# Altium project DAC_board.PrjPcb
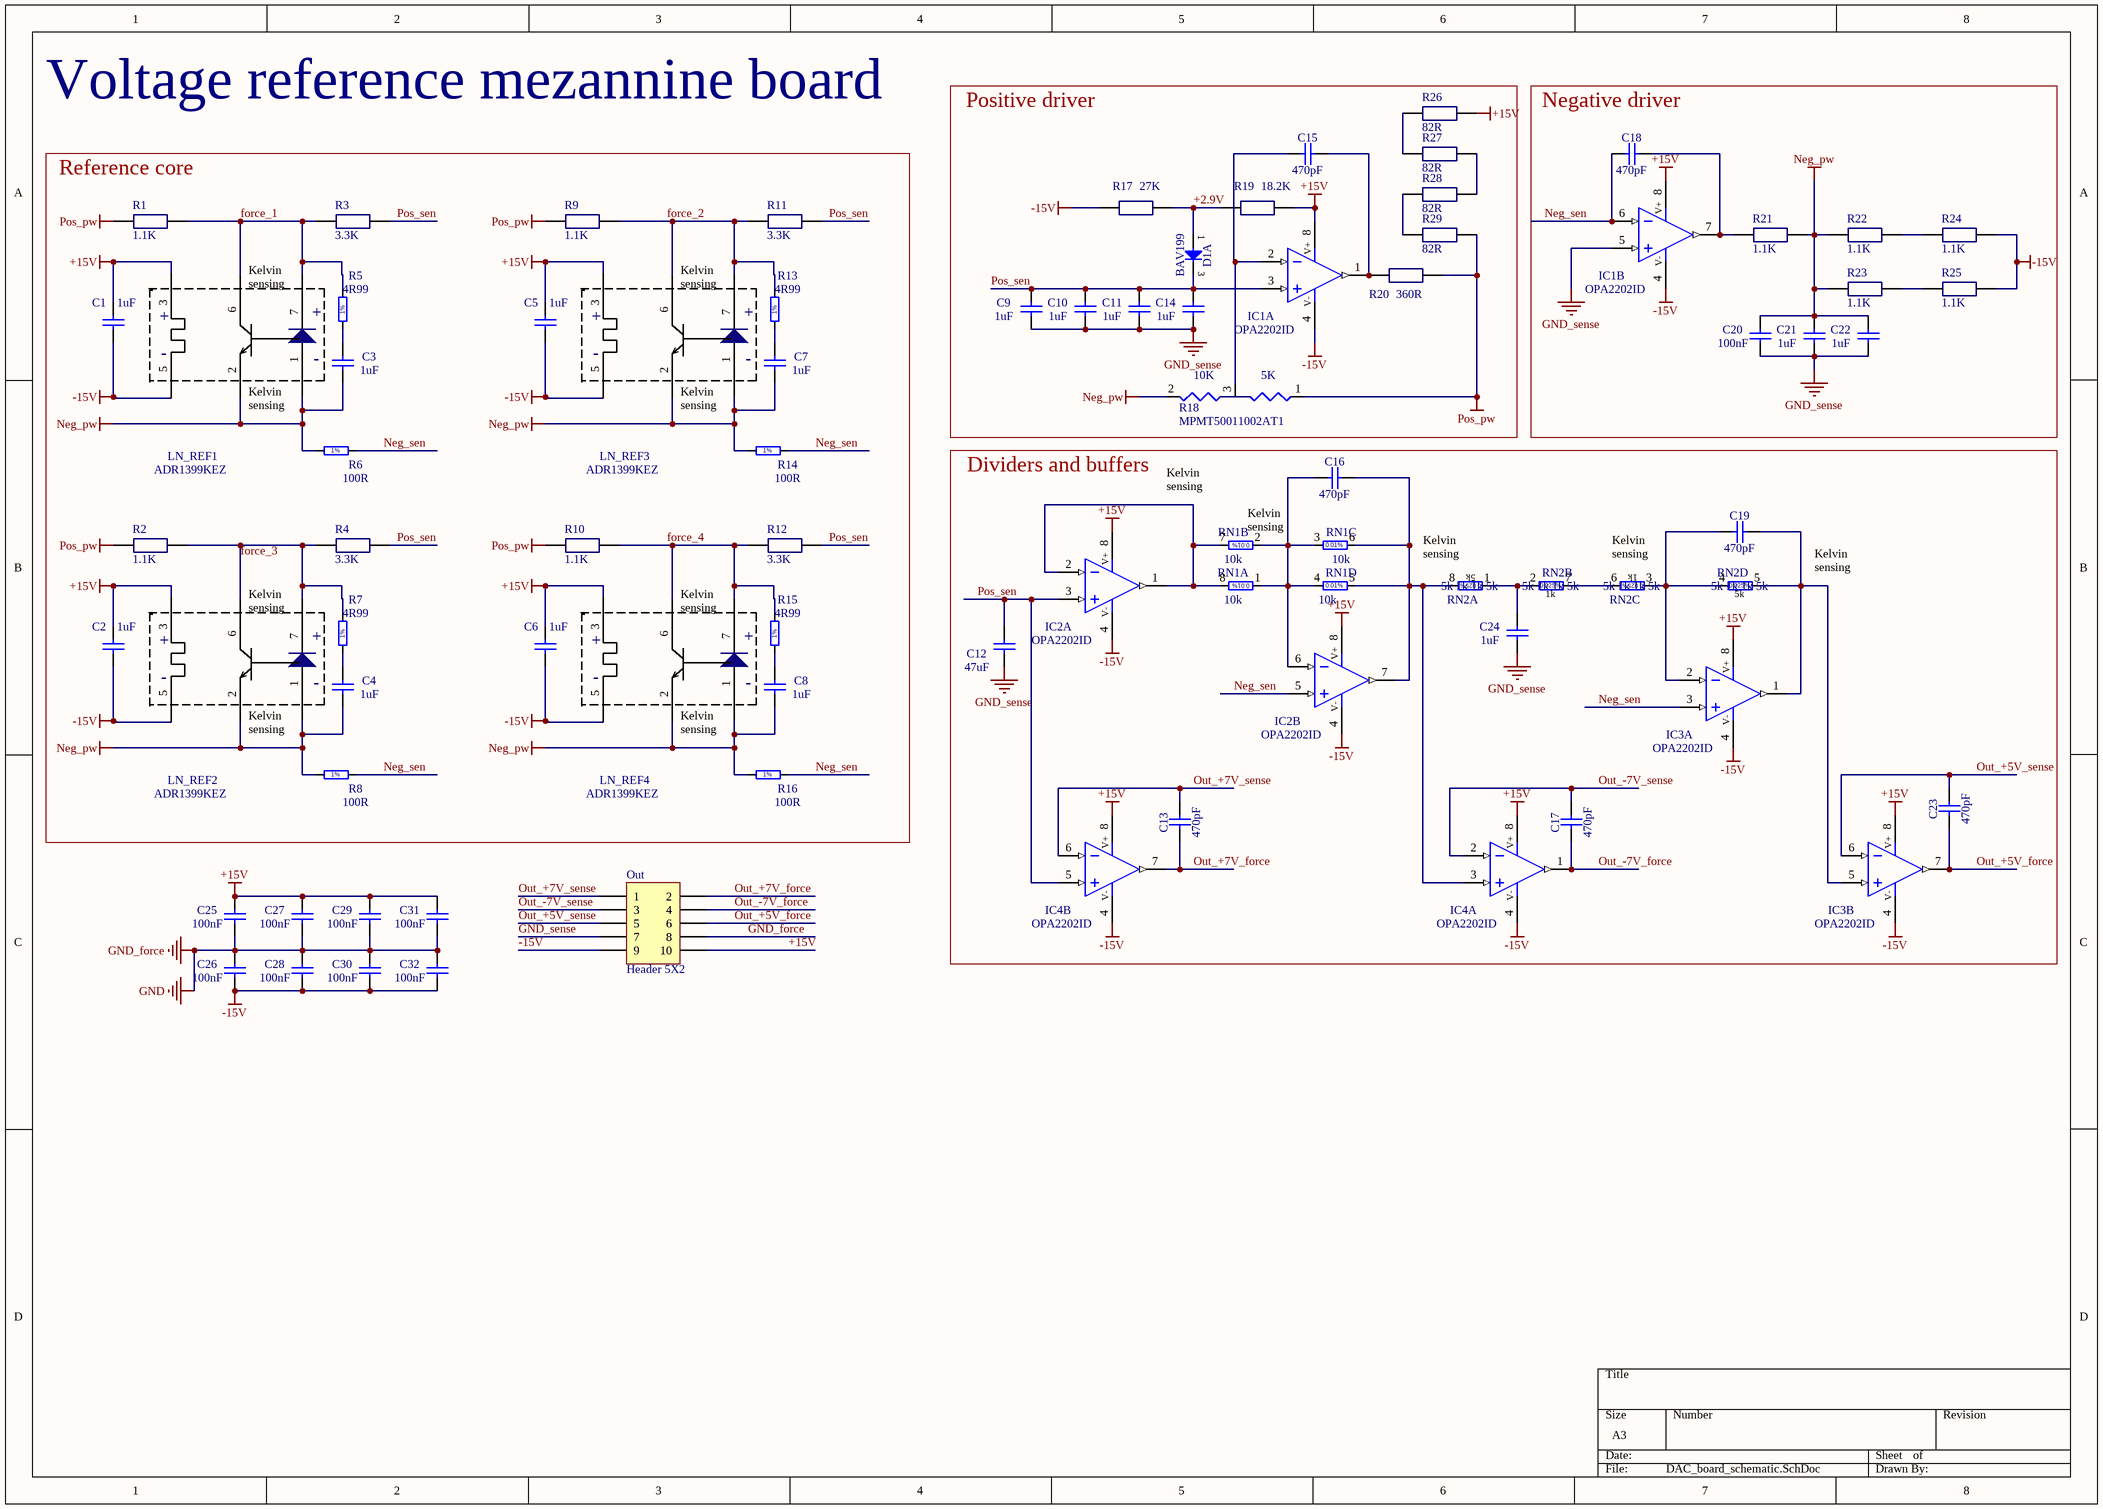
[diagram p0: DAC_board_schematic.SchDoc]
1 sheet, 73 parts. Net scope: global (net labels, ports and power ports of the same name join across sheets).
Board file: DAC_board_PCB.PcbDoc

## Sheet DAC_board_schematic.SchDoc
size A3

### Parts
C1  1uF  [C0805(2013)]
C2  1uF  [C0805(2013)]
C3  1uF  [C0805(2013)]
C4  1uF  [C0805(2013)]
C5  1uF  [C0805(2013)]
C6  1uF  [C0805(2013)]
C7  1uF  [C0805(2013)]
C8  1uF  [C0805(2013)]
C9  1uF  [C0805(2013)]
C10  1uF  [C0805(2013)]
C11  1uF  [C0805(2013)]
C12  47uF  [CAPC3225X270N]
C13  470pF  [CAPC1608X87N]
C14  1uF  [C0805(2013)]
C15  470pF  [CAPC1608X87N]
C16  470pF  [CAPC1608X87N]
C17  470pF  [CAPC1608X87N]
C18  470pF  [CAPC1608X87N]
C19  470pF  [CAPC1608X87N]
C20  100nF  [C0805(2013)]
C21  1uF  [C0805(2013)]
C22  1uF  [C0805(2013)]
C23  470pF  [CAPC1608X87N]
C24  1uF  [C0805(2013)]
C25  100nF  [C0805(2013)]
C26  100nF  [C0805(2013)]
C27  100nF  [C0805(2013)]
C28  100nF  [C0805(2013)]
C29  100nF  [C0805(2013)]
C30  100nF  [C0805(2013)]
C31  100nF  [C0805(2013)]
C32  100nF  [C0805(2013)]
D1  BAV199  [SOT95P240X110-3N]  (part A of 2)
IC1  OPA2202ID  [SOIC127P600X175-8N]  (parts A,B of 2)
IC2  OPA2202ID  [SOIC127P600X175-8N]  (parts A,B of 2)
IC3  OPA2202ID  [SOIC127P600X175-8N]  (parts A,B of 2)
IC4  OPA2202ID  [SOIC127P600X175-8N]  (parts A,B of 2)
LN_REF1  ADR1399KEZ  [ADR1399KEZ]
LN_REF2  ADR1399KEZ  [ADR1399KEZ]
LN_REF3  ADR1399KEZ  [ADR1399KEZ]
LN_REF4  ADR1399KEZ  [ADR1399KEZ]
Out  Header 5X2  [HDR2X5]
R1  1.1K  [R0603-1%]
R2  1.1K  [R0603-1%]
R3  3.3K  [R0603-1%]
R4  3.3K  [R0603-1%]
R5  4R99  [R0603-1%]
R6  100R  [R0603-1%]
R7  4R99  [R0603-1%]
R8  100R  [R0603-1%]
R9  1.1K  [R0603-1%]
R10  1.1K  [R0603-1%]
R11  3.3K  [R0603-1%]
R12  3.3K  [R0603-1%]
R13  4R99  [R0603-1%]
R14  100R  [R0603-1%]
R15  4R99  [R0603-1%]
R16  100R  [R0603-1%]
R17  27K  [R0603-1%]
R18  value 5K  Value2: 10K  [SOT23-3]  (hidden comment: MPMT50011002AT1)
R19  18.2K  [R0603-1%]
R20  360R  [R0603-1%]
R21  1.1K  [R0603-1%]
R22  1.1K  [R0603-1%]
R23  1.1K  [R0603-1%]
R24  1.1K  [R0603-1%]
R25  1.1K  [R0603-1%]
R26  82R  [R0603-1%]
R27  82R  [R0603-1%]
R28  82R  [R0603-1%]
R29  82R  [R0603-1%]
RN1  10k  [SOP65P490X110-9N-R168X188]  (parts A,B,C,D of 4)
RN2  5k 1k 1k 5k  [SOP65P490X110-9N-R168X188]  (parts A,B,C,D of 4)

### Blocks framed on the sheet
Positive driver: C9-C11 C14 C15 D1 IC1 R17-R20 R26-R29
Negative driver: C18 C20-C22 IC1 R21-R25
Reference core: C1-C8 LN_REF1-LN_REF4 R1-R16
Dividers and buffers: C12 C13 C16 C17 C19 C23 C24 IC2-IC4 RN1 RN2

### Nets
+15V: C1.2 C2.2 C5.2 C6.2 C25.2 C27.2 C29.2 C31.2 IC1.8(V+) IC2.8(V+) IC3.8(V+) IC4.8(V+) LN_REF1.3 LN_REF2.3 LN_REF3.3 LN_REF4.3 Out.10 R19.2 R26.1(A)
-15V: C1.1 C2.1 C5.1 C6.1 C26.1 C28.1 C30.1 C32.1 IC1.4(V-) IC2.4(V-) IC3.4(V-) IC4.4(V-) LN_REF1.5 LN_REF2.5 LN_REF3.5 LN_REF4.5 Out.9 R17.1(A) R24.2 R25.2
GND_force: C25.1 C26.2 C27.1 C28.2 C29.1 C30.2 C31.1 C32.2 Out.8 RN1.9(EP) RN2.9(EP)  [also labelled GND]
GND_sense: C9.1 C10.1 C11.1 C12.1 C14.1 C20.1 C21.1 C22.1 C24.1 IC1.5(IN+) Out.7
Neg_pw: C3.1 C4.1 C7.1 C8.1 C20.2 C21.2 C22.2 LN_REF1.1 LN_REF1.2 LN_REF2.1 LN_REF2.2 LN_REF3.1 LN_REF3.2 LN_REF4.1 LN_REF4.2 R6.1 R8.1 R14.1 R16.1 R18.2 R21.2 R22.1(A) R23.1(A)
Pos_pw: R1.1(A) R2.1(A) R9.1(A) R10.1(A) R18.1 R20.2 R29.1(A)
+2.9V: D1.1(A) R17.2 R19.1(A)
force_1: LN_REF1.6 LN_REF1.7 R1.2 R3.1(A) R5.2
force_2: LN_REF3.6 LN_REF3.7 R9.2 R11.1(A) R13.2
force_3: LN_REF2.6 LN_REF2.7 R2.2 R4.1(A) R7.2
force_4: LN_REF4.6 LN_REF4.7 R10.2 R12.1(A) R15.2
Neg_sen: C18.1 IC1.6(IN-) IC2.5(IN+) IC3.3(IN+) R6.2 R8.2 R14.2 R16.2
Out_+5V_force: C23.1 IC3.7(OUT) Out.6
Out_+5V_sense: C23.2 IC3.6(IN-) Out.5
Out_+7V_force: C13.1 IC4.7(OUT) Out.2
Out_+7V_sense: C13.2 IC4.6(IN-) Out.1
Out_-7V_force: C17.1 IC4.1(OUT) Out.4
Out_-7V_sense: C17.2 IC4.2(IN-) Out.3
Pos_sen: C9.2 C10.2 C11.2 C12.2 C14.2 D1.3(COMAC) IC1.3(IN+) IC2.3(IN+) IC4.5(IN+) R3.2 R4.2 R11.2 R12.2
NetC3_2: C3.2 R5.1
NetC4_2: C4.2 R7.1
NetC7_2: C7.2 R13.1
NetC8_2: C8.2 R15.1
NetC15_1: C15.1 IC1.2(IN-) R18.3
NetC15_2: C15.2 IC1.1(OUT) R20.1(A)
NetC16_1: C16.1 IC2.6(IN-) RN1.1 RN1.2 RN1.3 RN1.4
NetC16_2: C16.2 IC2.7(OUT) IC4.3(IN+) RN1.5 RN1.6 RN2.8
NetC18_2: C18.2 IC1.7(OUT) R21.1(A)
NetC19_1: C19.1 IC3.2(IN-) RN2.3 RN2.4
NetC19_2: C19.2 IC3.1(OUT) IC3.5(IN+) RN2.5
NetC24_2: C24.2 RN2.1 RN2.2
NetIC2_1: IC2.1(OUT) IC2.2(IN-) RN1.7 RN1.8
NetR22_2: R22.2 R24.1(A)
NetR23_2: R23.2 R25.1(A)
NetR26_2: R26.2 R27.2
NetR27_1: R27.1(A) R28.1(A)
NetR28_2: R28.2 R29.2
NetRN2_6: RN2.6 RN2.7

### Notes on the sheet
- Voltage reference mezannine board
- Kelvin sensing
- (near RN1) Kelvin sensing
- (near RN2) Kelvin sensing
- (in symbol ADR1399KEZ) +; -
- (in symbol R1206_5R6_1%_0.25W_200PPM) 1%
- (in symbol RN_5K_1K_LINEAR_LT5400BCMS8E-6#PBF, part A) 5k
- (in symbol RN_5K_1K_LINEAR_LT5400BCMS8E-6#PBF, part B) 1k
- (in symbol RN_5K_1K_LINEAR_LT5400BCMS8E-6#PBF, part C) 1k
- (in symbol RN_5K_1K_LINEAR_LT5400BCMS8E-6#PBF, part D) 5k

### Library data of the parts
C1-C11 C14 C20-C22 C24-C32 = CC1206_1UF_25V_10%_X7R: Non-polarised capacitor; Part Description: SMD Multilayer Chip Ceramic Capacitor; Manufacturer: GENERIC; Manufacturer1 Part Number: C1206C105K3RAC; Voltage: 25V; TC: X7R; Tolerance: ±10%; Part Number: CC1206_1UF_25V_10%_X7R; Component Kind: Standard; Component Type: Standard; Footprint: CAPC3216X140N; Pin Count: 2; Status: Preferred; Manufacturer Part Number: CC1206_1UF_25V_10%_X7R; Case: 1206; Mounted: Yes; Socket: No; SMD: Yes; Sense: No; Manufacturer1 Example: KEMET; Manufacturer1 ComponentHeight: 1.75mm; HelpURL: \\cern.ch\dfs\Applications\Altium\Datasheets\CC1206_X7R_KEMET.pdf; Author: CERN DEM JLC; CreateDate: 03.12.2007; LatestRevisionDate: 03.12.2007
  C1-C11 C14 C21 C22 C24: Value: 1uF
  C20 C25-C32: Value: 100nF
C12 = CC1210_47UF_10V_10%_X7R: Non-polarised capacitor; Part Description: SMD Multilayer Chip Ceramic Capacitor; Manufacturer: GENERIC; Manufacturer1 Part Number: GRM32ER71A476KE15; Voltage: 10V; TC: X7R; Tolerance: ±10%; Part Number: CC1210_47UF_10V_10%_X7R; Component Kind: Standard; Component Type: Standard; Pin Count: 2; Value: 47uF; Status: None; Manufacturer Part Number: CC1210_47UF_10V_10%_X7R; Case: 1210; Mounted: Yes; Socket: No; SMD: Yes; Sense: No; Manufacturer1 Example: MURATA; Manufacturer1 ComponentHeight: 2.7mm; HelpURL: \\cern.ch\dfs\Applications\Altium\Datasheets\CC1210_X7R_MURATA.pdf; Author: CERN DEM BC; CreateDate: 18.11.2015; LatestRevisionDate: 18.11.2015
C13 C15-C19 C23 = CC0603_470PF_50V_5%_NP0: Non-polarised capacitor; Part Description: SMD Multilayer Chip Ceramic Capacitor; Manufacturer: GENERIC; Manufacturer1 Part Number: 223886715471; Voltage: 50V; TC: C0G/NP0; Tolerance: ±5%; Part Number: CC0603_470PF_50V_5%_NP0; Component Kind: Standard; Component Type: Standard; Pin Count: 2; Value: 470pF; Status: Preferred; Manufacturer Part Number: CC0603_470PF_50V_5%_NP0; Case: 0603; Mounted: Yes; Socket: No; SMD: Yes; Sense: No; Manufacturer1 Example: PHYCOMP; Manufacturer1 ComponentHeight: 0.87mm; HelpURL: \\cern.ch\dfs\Applications\Altium\Datasheets\CC0603_NP0_PHYCOMP.pdf; Author: CERN DEM JLC; CreateDate: 03.12.2007; LatestRevisionDate: 03.12.2007
D1 = BAV199: Serial Diode; Part Description: Low-Leakage Double Diode; Manufacturer: NXP SEMICONDUCTORS; Voltage: 75V; Power: 250mW; PressFit: No; Bonding: No; Part Number: BAV199; Component Kind: Standard; Component Type: Standard; Device: BAV199; PackageDescription: SOT23 3-Leads, Pitch 0.95mm - Body 1.4x3mm, IPC Medium Density; Manufacturer Part Number: BAV199; Pin Count: 3; Case: SOT23-3; Mounted: Yes; Socket: No; SMD: Yes; Sense: No; ComponentHeight: 1.1mm; HelpURL: \\cern.ch\dfs\Applications\Altium\Datasheets\BAV199.pdf; Author: CERN DEM JMW; CreateDate: 21.11.2008; LatestRevisionDate: 21.11.2008
IC1-IC4 = OPA1612AID: Dual Operational Amplifier; Part Description: Dual, SoundPlus™, High-Performance, Bipolar-Input Audio Operational Amplifier; Manufacturer: TEXAS INSTRUMENTS; PressFit: No; Bonding: No; Part Number: OPA2202ID; Component Kind: Standard; Component Type: Standard; Device: OPA2202ID; PackageDescription: SOIC 8, Pitch 1.27mm - Body 4x5mm, IPC Medium Density; Manufacturer Part Number: OPA1612AID; Pin Count: 8; Case: SOIC8; Mounted: Yes; Socket: No; SMD: Yes; Sense: No; ComponentHeight: 1.75mm; Author: CERN DEM JLC; HelpURL: \\cern.ch\dfs\Applications\Altium\Datasheets\OPA1612AID.pdf; CreateDate: 28.06.2011; LatestRevisionDate: 28.06.2011
Out = Header 5X2: Header, 5-Pin, Dual row; LatestRevisionDate: 17-Jul-2002; LatestRevisionNote: Re-released for DXP Platform.; Publisher: Altium Limited
R1-R4 R9-R12 R17 R19-R29 = Resistor 0805: Order: ERA-3AEB49R9V; Avail: 20; BOM Order: ERA-3AEB2671V
  R1 R2 R9 R10 R21-R25: Value: 1.1K
  R3 R4 R11 R12: Value: 3.3K
  R17: Value: 27K
  R19: Value: 18.2K
  R20: Value: 360R
  R26-R29: Value: 82R
R5-R8 R13-R16 = R1206_5R6_1%_0.25W_200PPM: Resistor - 1%; Part Description: General Purpose Thick Film Chip Resistor; Manufacturer: GENERIC; Manufacturer1 Part Number: 232272465608L or RC1206FR-075R6L; Power: 0.25W; TC: ±200ppm/°C; PressFit: No; Part Number: R1206_5R6_1%_0.25W_200PPM; Component Kind: Standard; Component Type: Standard; Footprint: RESC3216X65N; Pin Count: 2; Status: Preferred; Tolerance: ±1%; Manufacturer Part Number: R1206_5R6_1%_0.25W_200PPM; Case: 1206; Mounted: Yes; Sense: No; Socket: No; SMD: Yes; Manufacturer1 Example: YAGEO PHYCOMP; Manufacturer1 ComponentHeight: 0.65mm; HelpURL: \\cern.ch\dfs\Applications\Altium\Datasheets\R1206_Phycomp_RC1206.pdf; Author: CERN DEM JLC; CreateDate: 24.06.2009; LatestRevisionDate: 17.10.2012
  R5 R7 R13 R15: Value: 4R99
  R6 R8 R14 R16: Value: 100R
R18 = MPMT: Published: 8-Jun-2000; LatestRevisionDate: 29-May-2009; LatestRevisionNote: IPC-7351 Footprint Added.; PackageReference: J1-0603; Publisher: Altium Limited; PackageDescription: Chip Resistor; Order: MPMT50011002AT1
RN1 = RN_10K_10K_LINEAR_LT5400ACMS8E-1#PBF: DIL8 Resistor Network 4 Isolated Resistor 0.01% + Exposed Pad; Part Description: Quad Matched Resistor Network - LT5400 Series; Manufacturer: LINEAR TECHNOLOGY; Power: 4x0.8W; TC: ±0.2ppm/°C; PressFit: No; Part Number: RN_10K_10K_LINEAR_LT5400ACMS8E-1#PBF; Component Kind: Standard; Component Type: Standard; Pin Count: 9; Value: 10k; Sense: No; Tolerance: 0.01%; Manufacturer Part Number: LT5400ACMS8E-1#PBF; Case: MSOP8; Mounted: Yes; Socket: No; SMD: Yes; ComponentHeight: 1.1mm; HelpURL: \\cern.ch\dfs\Applications\Altium\Datasheets\RN_LINEAR_LT5400.pdf; Author: CERN DEM JLC; CreateDate: 01.07.2014; LatestRevisionDate: 17.07.2014
RN2 = RN_5K_1K_LINEAR_LT5400BCMS8E-6#PBF: DIL8 Resistor Network 4 Resistors 5k-1k-1k-5k 0.025%; Part Description: Quad Matched Resistor Network - LT5400 Series; Manufacturer: LINEAR TECHNOLOGY; Power: 4x0.8W; TC: ±0.2ppm/°C; PressFit: No; Part Number: RN_5K_1K_LINEAR_LT5400BCMS8E-6#PBF; Component Kind: Standard; Component Type: Standard; Pin Count: 9; Value: 5k 1k 1k 5k; Sense: No; Tolerance: 0.025%; Manufacturer Part Number: LT5400BCMS8E-6#PBF; Case: MSOP8; Mounted: Yes; Socket: No; SMD: Yes; ComponentHeight: 1.1mm; HelpURL: \\cern.ch\dfs\Applications\Altium\Datasheets\RN_LINEAR_LT5400.pdf; Author: CERN DEM BC; CreateDate: 19.08.2016; LatestRevisionDate: 19.08.2016